# EAGLE design hr20 (EAGLE 6.6.0)
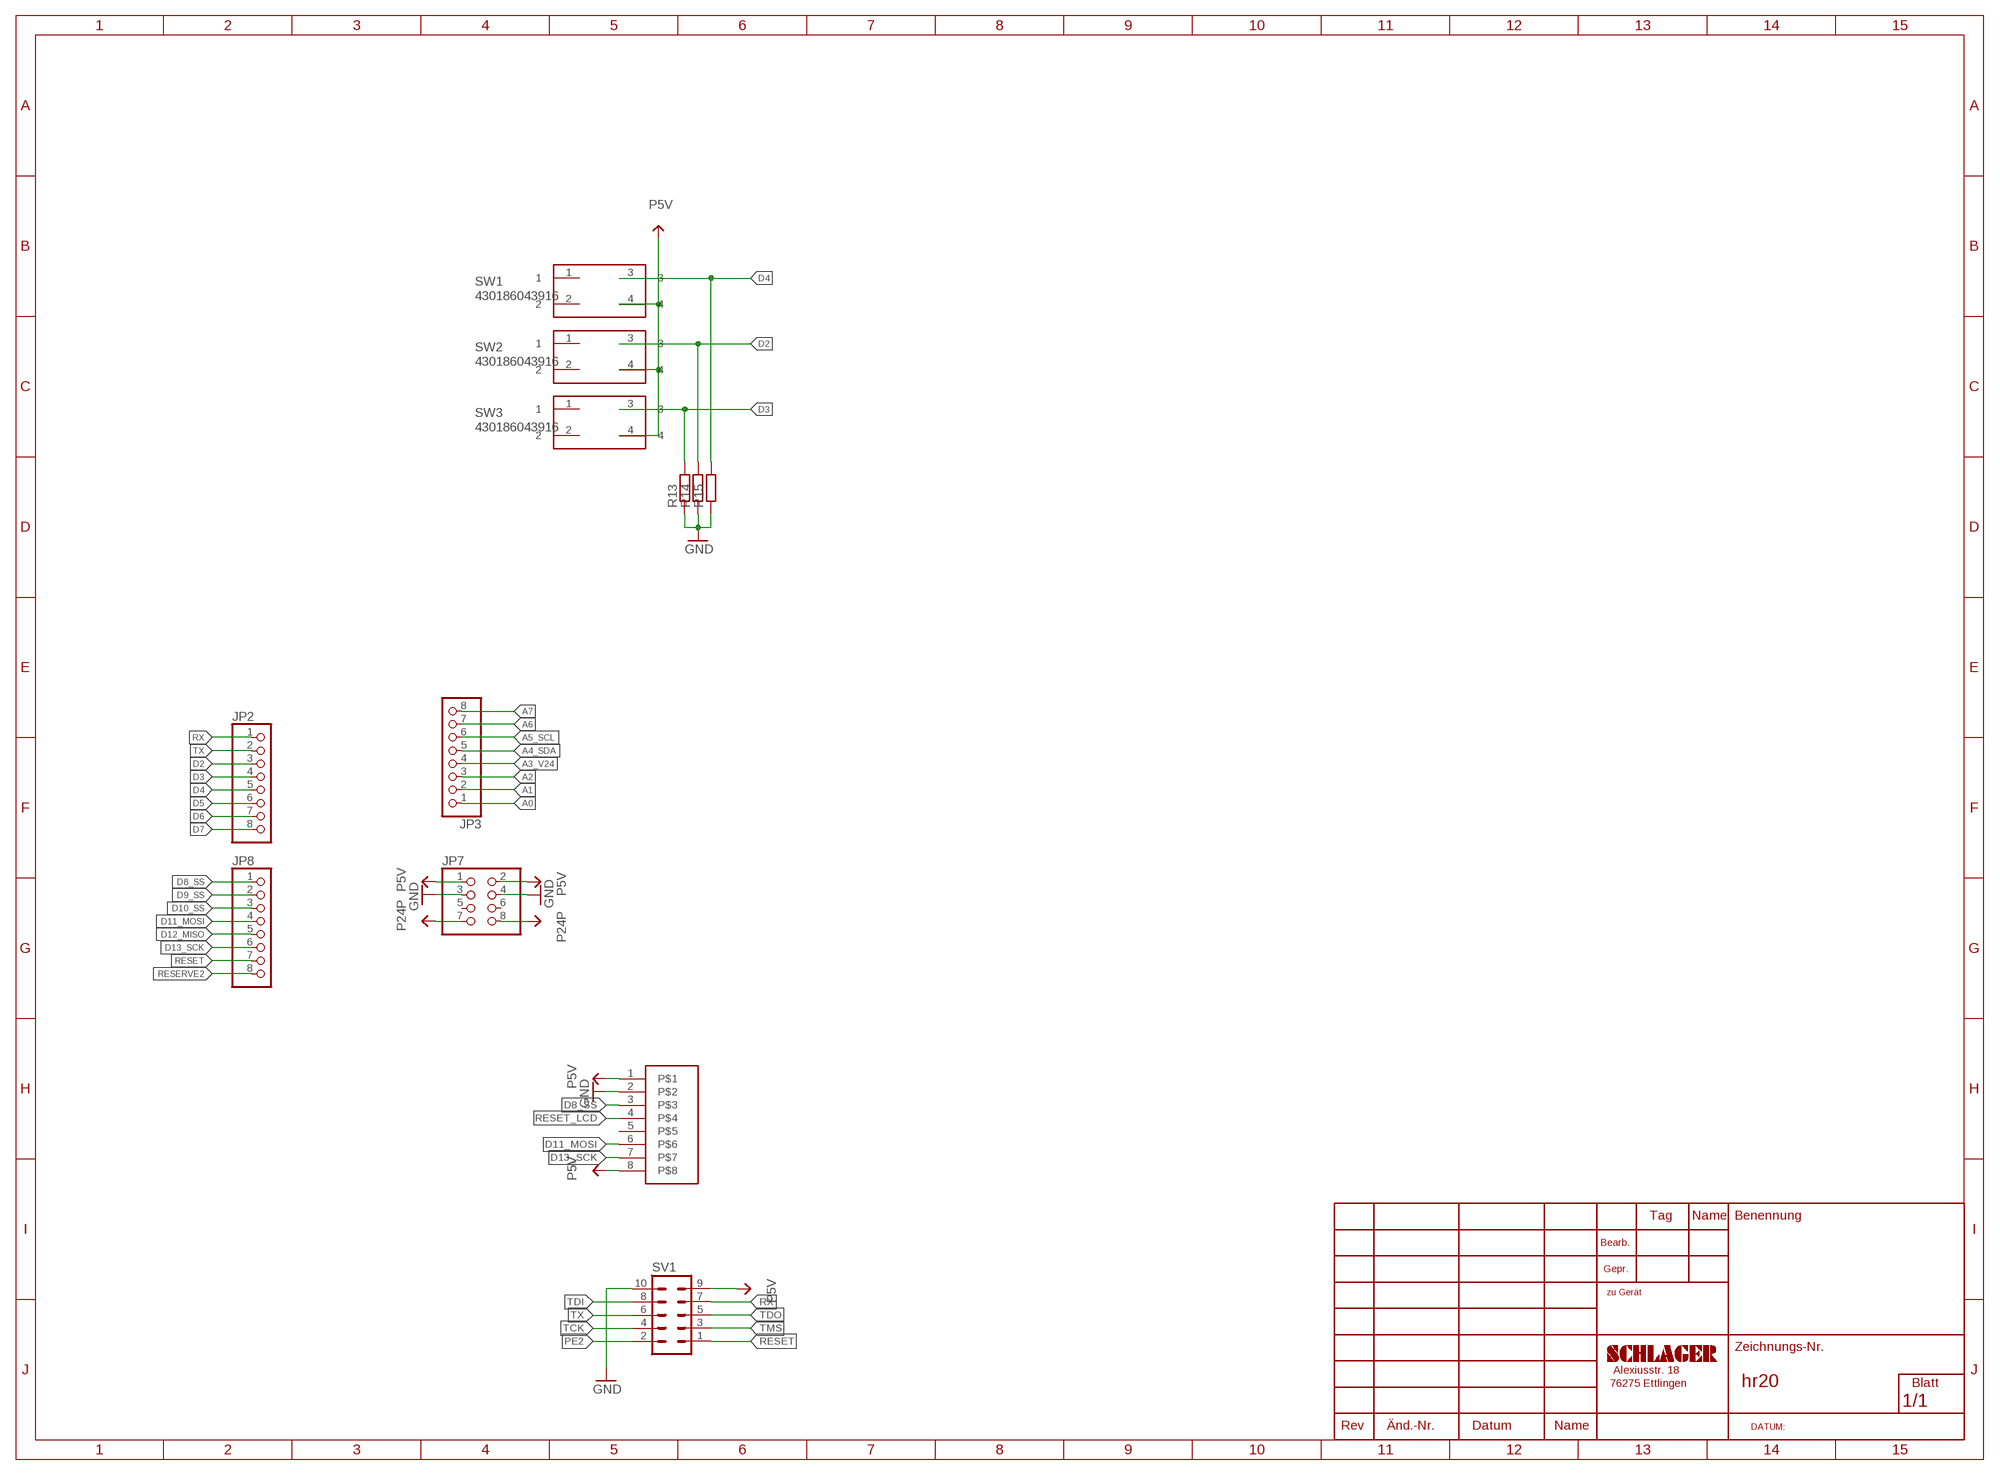
[diagram p0: schematic, sheet 1]

## Parts
JP2  PINHD-1X8  [1X08]
JP3  PINHD-1X8  [1X08]
JP7  PINHD-2X4  [2X04]
JP8  PINHD-1X8  [1X08]
R13  R-EU_0207/10  [0207/10]
R14  R-EU_0207/10  [0207/10]
R15  R-EU_0207/10  [0207/10]
SV1  ML10  [ML10]
SW1  430186043916  [430186043916]
SW2  430186043916  [430186043916]
SW3  430186043916  [430186043916]
U$2  1.44-128X128  [1.44-128X128]

## Nets
A0: JP3.1
A1: JP3.2
A2: JP3.3
A3_V24: JP3.4
A4_SDA: JP3.5
A5_SCL: JP3.6
D2: JP2.3 R14.2 SW2.3
D3: JP2.4 R13.2 SW3.3
D4: JP2.5 R15.2 SW1.3
D5: JP2.6
D6: JP2.7
D7: JP2.8
D8_SS: JP8.1 U$2.3
D9_SS: JP8.2
D10_SS: JP8.3
D11_MOSI: JP8.4 U$2.6
D12_MISO: JP8.5
D13_SCK: JP8.6 U$2.7
GND: JP7.3 JP7.4 R13.1 R14.1 R15.1 SV1.10 U$2.2
P5V: JP7.1 JP7.2 SV1.9 SW1.4 SW2.4 SW3.4 U$2.1 U$2.8
P24P: JP7.7 JP7.8
PE2: SV1.2
RESERVE2: JP8.8
RESET: JP8.7 SV1.1
RESET_LCD: U$2.4
RX: JP2.1 SV1.7
TCK: SV1.4
TDI: SV1.8
TDO: SV1.5
TMS: SV1.3
TX: JP2.2 SV1.6
Unconnected: JP3.7 JP3.8 JP7.5 JP7.6 SW1.1 SW1.2 SW2.1 SW2.2 SW3.1 SW3.2 U$2.5

## Library data of the parts
JP2 JP3 JP8 = pinhead:PINHD-1X8: PIN HEADER
JP7 = pinhead:PINHD-2X4: PIN HEADER
R13-R15 = schlager_passiv:R-EU_: RESISTOR, European symbol
SV1 = X_Pfostenstecker:ML10: HARTING; OC_FARNELL: unknown; OC_NEWARK: unknown
SW1-SW3 = Wuerth_Elektronik_Switch:430186043916: WS-TST-6x6 mm THT Tact Switch,4 pins
U$2 = schlager_modules:1.44-128X128

## Net classes
4 USBpair: width 0.254 mm, drill 0.406 mm, clearance 0.508 mm

## Board
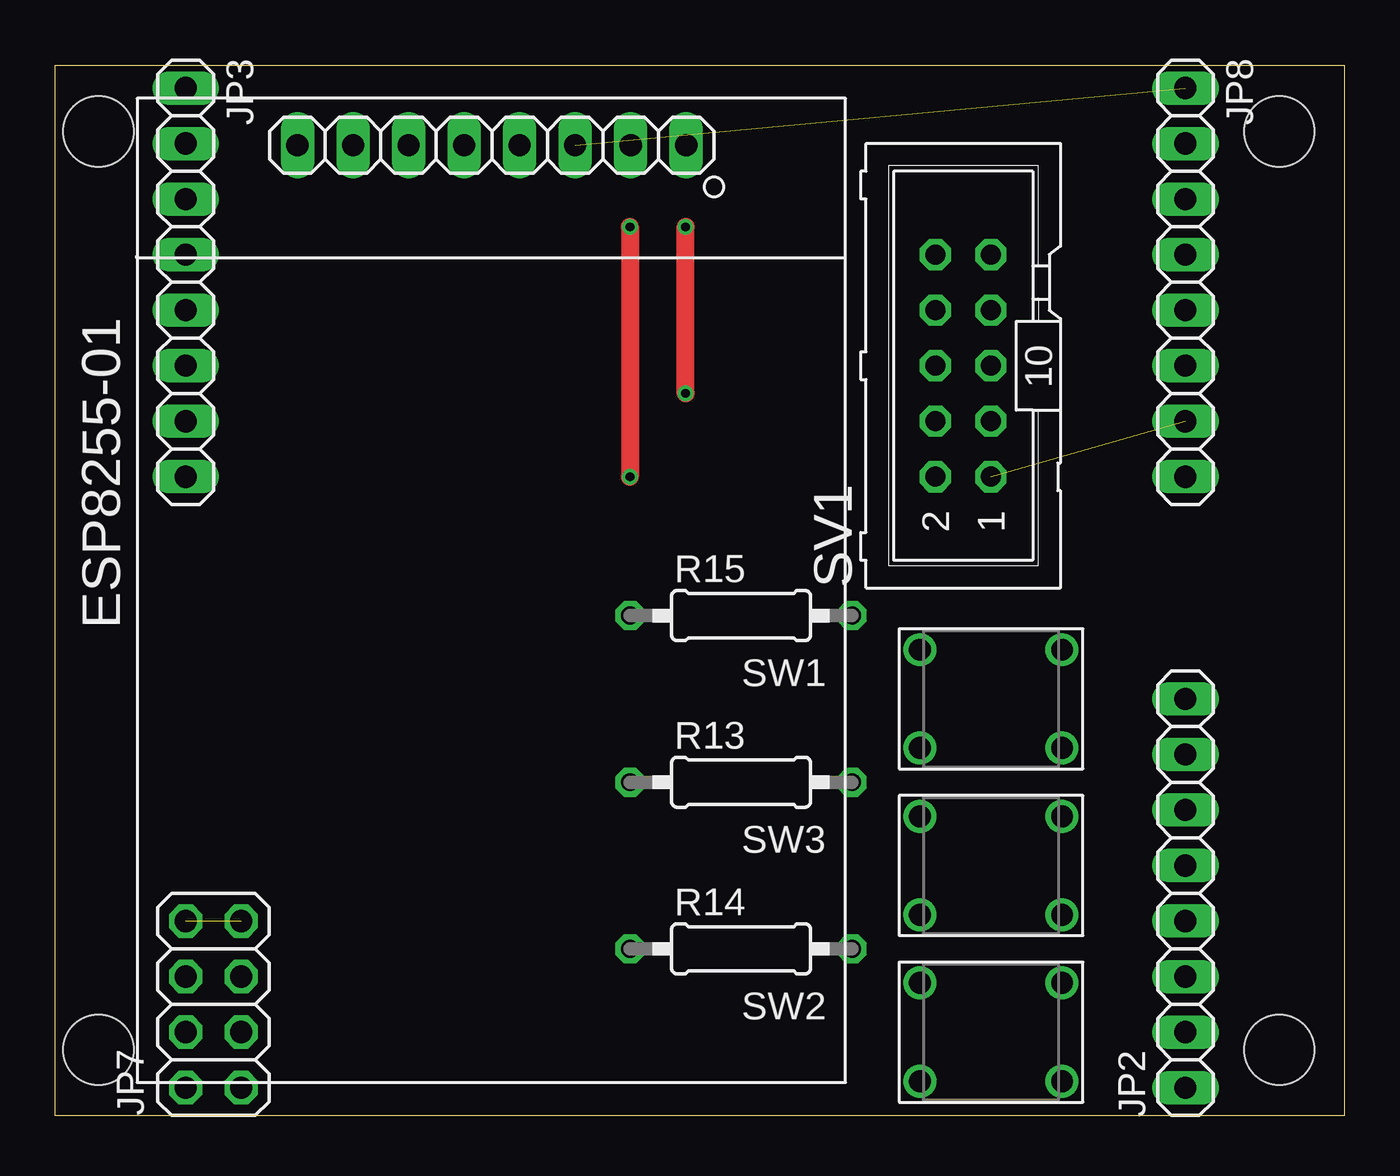
[diagram p1: board, top side]
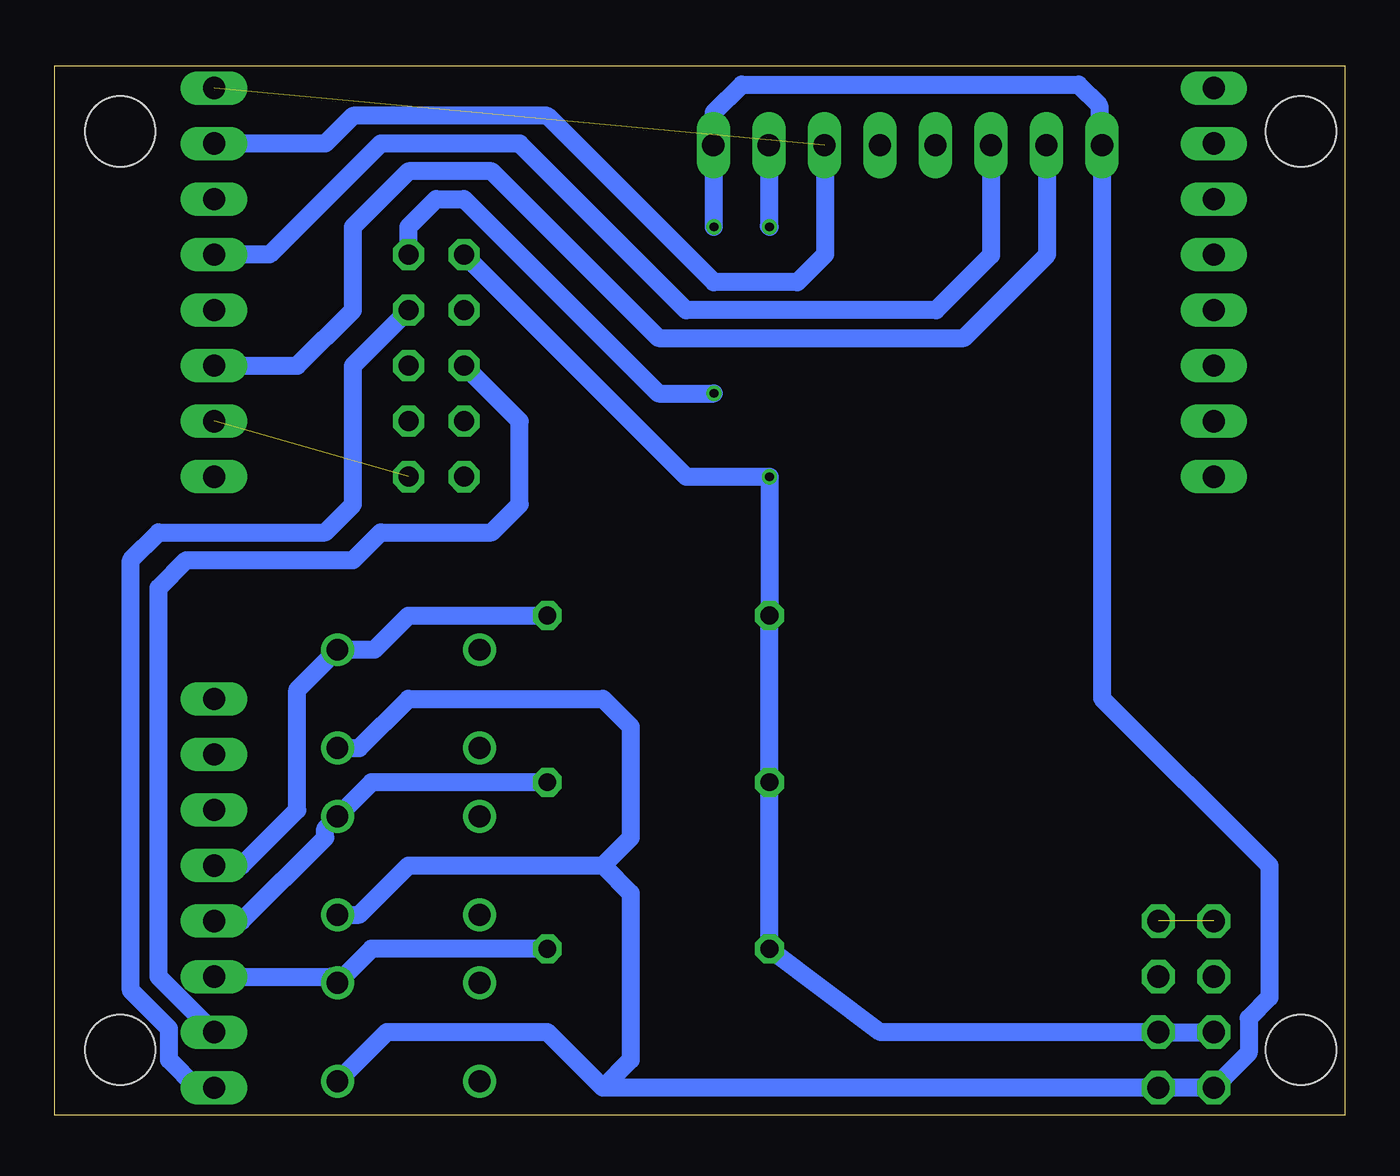
[diagram p2: board, bottom side, seen from below]

Size 59 x 48 mm. Coordinates in mm from the lower left corner, seen from the top.
Outline: 0,0 59,0 59,48 0,48 0,0
Copper layers (1*16): Top 0.035mm / dielectric 1.5mm / Bottom 0.035mm
Design rules "ITEADstudio_DRC": minimum track width 6mil, minimum drill 12mil, track to track 6mil, track to pad 6mil, pad to pad 6mil, via to via 6mil, smd to smd 0mil, copper to edge 10mil, drill to drill 10mil, minimum pad ring 10mil, minimum via ring 6mil, stop-mask expansion 2mil, vias tented up to drill 100mil, thermal gap 10mil
Holes 3.2 mm at 56,45 56,3 2,3 2,45

### Footprints (pad centres in the part's own frame; a part is rotated, then mirrored left to right if it is on the bottom)
1X08 = drill 1.016 long: 1 -8.89,0; 2 -6.35,0; 3 -3.81,0; 4 -1.27,0; 5 1.27,0; 6 3.81,0; 7 6.35,0; 8 8.89,0
2X04 = drill 1.016 octagon: 1 -3.81,-1.27; 2 -3.81,1.27; 3 -1.27,-1.27; 4 -1.27,1.27; 5 1.27,-1.27; 6 1.27,1.27; 7 3.81,-1.27; 8 3.81,1.27
0207/10 = drill 0.813 octagon: 1 -5.08,0; 2 5.08,0
ML10 = drill 0.914 octagon: 1 -5.08,-1.27; 2 -5.08,1.27; 3 -2.54,-1.27; 4 -2.54,1.27; 5 0,-1.27; 6 0,1.27; 7 2.54,-1.27; 8 2.54,1.27; 9 5.08,-1.27; 10 5.08,1.27
430186043916 = drill 1: 1 -3.25,2.25; 2 -3.25,-2.25; 3 3.25,2.25; 4 3.25,-2.25
1.44-128X128 = drill 1.016 long: 1 7.27,2.14; 2 9.81,2.14; 3 12.35,2.14; 4 14.89,2.14; 5 17.43,2.14; 6 19.97,2.14; 7 22.51,2.14; 8 25.05,2.14

### Placement (x,y rotation side)
JP2  51.71,10.16 90 top
JP3  5.99,38.1 270 top
JP7  7.26,5.08 90 top
JP8  51.71,38.1 270 top
R13  31.39,15.24 0 top
R14  31.39,7.62 0 top
R15  31.39,22.86 0 top
SV1  41.55,34.29 90 top
SW1  42.82,19.05 0 top
SW2  42.82,3.81 0 top
SW3  42.82,11.43 0 top
U$2  36.15,46.51 180 top

### Tracks (layer width: path | path; a pad name or v marks a point on that pad's centre or on a via)
D2
  Bottom 0.813: R14.2 44.51,7.62 SW2.3 46.36,6.35 JP2.3
D3
  Bottom 0.813: R13.2 44.51,15.24 SW3.3 46.63,13.12 46.63,12.7 50.44,8.89 JP2.4
D4
  Bottom 0.813: JP2.5 50.44,11.43 47.9,13.97 47.9,19.47 SW1.3 44.38,21.3 42.82,22.86 R15.2
D8_SS  (1 unrouted)
D9_SS
  Bottom 0.813: 23.77,44.34 23.77,39.37 25.04,38.1 28.85,38.1 36.47,45.72 45.36,45.72 46.63,44.45 JP8.2
D11_MOSI
  Bottom 0.813: U$2.6 16.18,39.34 18.69,36.83 30.12,36.83 37.74,44.45 44.09,44.45 49.17,39.37 JP8.4
D13_SCK
  Bottom 0.813: JP8.6 47.9,34.29 45.36,36.83 45.36,40.64 42.82,43.18 39.01,43.18 31.39,35.56 17.42,35.56 13.61,39.37 13.61,44.34 U$2.7
GND  (via drill 0.4)
  Top 0.813: v26.31,40.64 v26.31,29.21
  Bottom 0.813: JP7.4 JP7.3 21.23,3.81 R14.1 R13.1 R15.1 v26.31,29.21 30.12,29.21 SV1.10 | U$2.2 26.34,40.67 v26.31,40.64
P5V  (via drill 0.4)
  Top 0.813: v28.85,33.02 v28.85,40.64
  Bottom 0.813: 33.93,1.27 JP7.1 JP7.2 4.4,2.86 4.4,4.45 3.45,5.4 3.45,11.43 11.1,19.08 U$2.8 11.23,44.5 11.23,46.2 12.18,47.15 27.58,47.15 28.85,45.88 28.85,44.34 | 33.93,1.27 36.47,3.81 43.82,3.81 SW2.4 | SW3.4 45.07,9.18 42.82,11.43 33.93,11.43 | 33.93,11.43 32.66,10.16 32.66,2.54 33.93,1.27 | SW1.4 45.07,16.8 42.82,19.05 33.93,19.05 32.66,17.78 32.66,12.7 33.93,11.43 | v28.85,40.64 28.85,44.34 | 28.85,44.34 U$2.1 | SV1.9 42.82,40.64 41.55,41.91 40.28,41.91 31.39,33.02 v28.85,33.02
P24P  (1 unrouted)
RESET  (1 unrouted)
RX
  Bottom 0.813: JP2.1 52.5,1.27 53.77,2.54 53.77,3.97 55.52,5.71 55.52,25.4 54.25,26.67 46.63,26.67 45.36,27.94 45.36,34.29 SV1.7
TX
  Bottom 0.813: JP2.2 54.25,6.35 54.25,24.13 52.98,25.4 45.36,25.4 44.09,26.67 39.01,26.67 37.74,27.94 37.74,31.75 SV1.6

### Text on the board
tNames: ESP8255-01 | ESP8255-01
bNames: ESP8255-01 | i2c